# Altium schematic sheet Э3-6 Электропитание.SchDoc
size 594 x 420 mm; Address1: Address1; Address2: Address2; Address3: Address3; Address4: Address4; DocumentNumber: АБВГ.123456.001 Э3; SheetNumber: 7; SheetTotal: 7; Scale: 1:1; DocumentType: Схема электрическая принципиальная; FirstReferrence: АБВГ.123456.001
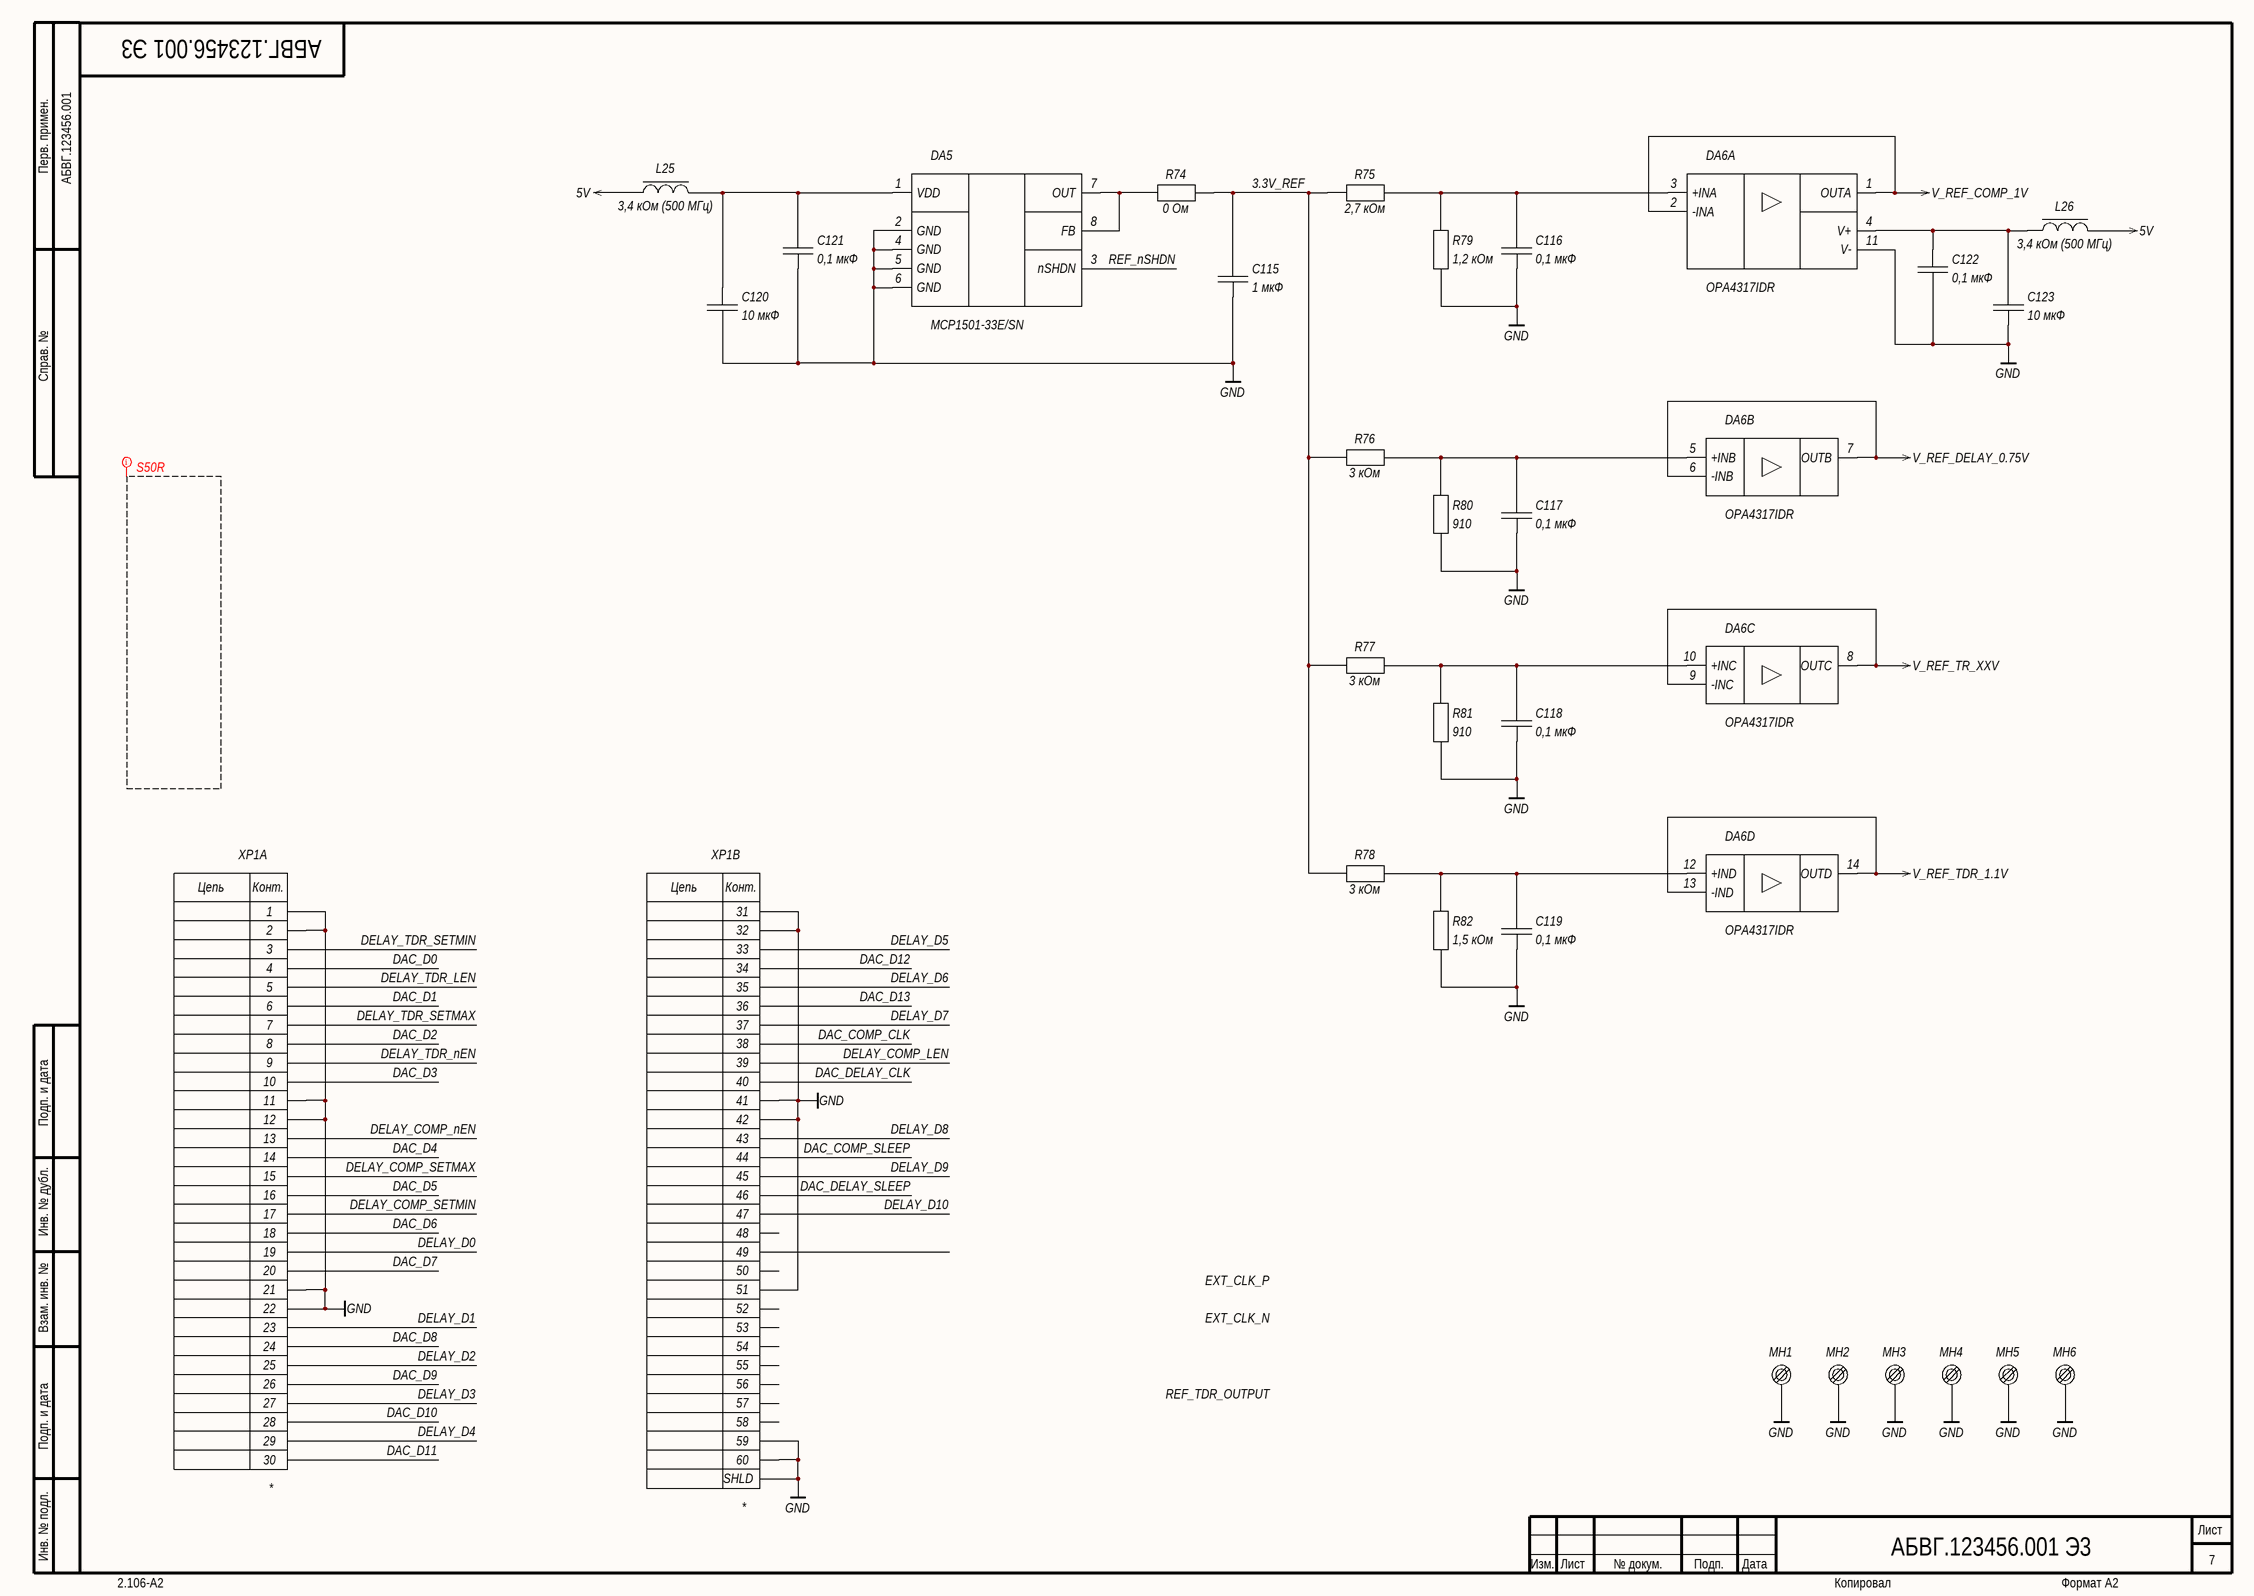
[diagram p0: Э3-6 Электропитание.SchDoc]

## Parts
C115  value 1 мкФ  [C0402-B-0.5mm]
C116  value 0,1 мкФ  [C0402-B-0.5mm]
C117  value 0,1 мкФ  [C0402-B-0.5mm]
C118  value 0,1 мкФ  [C0402-B-0.5mm]
C119  value 0,1 мкФ  [C0402-B-0.5mm]
C120  value 10 мкФ  [C0603-B-0.8mm]
C121  value 0,1 мкФ  [C0402-B-0.5mm]
C122  value 0,1 мкФ  [C0402-B-0.5mm]
C123  value 10 мкФ  [C0603-B-0.8mm]
DA5  MCP1501-33E/SN  [8-SOIC-3.9]
DA6  OPA4317IDR  [14-SOIC-3.9]  (value not drawn)  (parts A,B,C,D of 4)
L25  value 3,4 кОм (500 МГц)  [L0402-B-0.5mm]
L26  value 3,4 кОм (500 МГц)  [L0402-B-0.5mm]
MH1  Mechanical Connection  [Отверстие 2,4x5]  (value not drawn)
MH2  Mechanical Connection  [Отверстие 2,4x5]  (value not drawn)
MH3  Mechanical Connection  [Отверстие 2,4x5]  (value not drawn)
MH4  Mechanical Connection  [Отверстие 2,4x5]  (value not drawn)
MH5  Mechanical Connection  [Отверстие 2,4x5]  (value not drawn)
MH6  Mechanical Connection  [Отверстие 2,4x5]  (value not drawn)
R74  value 0 Ом  [CR0402-B-0.35mm]
R75  value 2,7 кОм  [CR0402-B-0.35mm]
R76  value 3 кОм  [CR0402-B-0.35mm]
R77  value 3 кОм  [CR0402-B-0.35mm]
R78  value 3 кОм  [CR0402-B-0.35mm]
R79  value 1,2 кОм  [CR0402-B-0.35mm]
R80  value 910  [CR0402-B-0.35mm]
R81  value 910  [CR0402-B-0.35mm]
R82  value 1,5 кОм  [CR0402-B-0.35mm]
XP1  *  [AXT460324]  (value not drawn)  (parts A,B of 2)

## Nets
5V: L25.1 L26.2
GND: C115.2 C116.2 C117.2 C118.2 C119.2 C120.2 C121.2 C122.2 C123.2 DA5.2(GND) DA5.4(GND) DA5.5(GND) DA5.6(GND) DA6.11(V-) MH1.0 MH2.0 MH3.0 MH4.0 MH5.0 MH6.0 R79.2 R80.2 R81.2 R82.2 XP1.1 XP1.2 XP1.11 XP1.12 XP1.21 XP1.22 XP1.31 XP1.32 XP1.41 XP1.42 XP1.51 XP1.59 XP1.60 XP1.SHLD
V_REF_COMP_1V: DA6.1(OUTA) DA6.2(-INA)
V_REF_DELAY_0.75V: DA6.6(-INB) DA6.7(OUTB)
V_REF_TDR_1.1V: DA6.13(-IND) DA6.14(OUTD)
V_REF_TR_XXV: DA6.8(OUTC) DA6.9(-INC)
3.3V_REF: C115.1 R74.2 R75.1 R76.1 R77.1 R78.1
DAC_COMP_CLK: XP1.38
DAC_COMP_SLEEP: XP1.44
DAC_D0: XP1.4
DAC_D1: XP1.6
DAC_D2: XP1.8
DAC_D3: XP1.10
DAC_D4: XP1.14
DAC_D5: XP1.16
DAC_D6: XP1.18
DAC_D7: XP1.20
DAC_D8: XP1.24
DAC_D9: XP1.26
DAC_D10: XP1.28
DAC_D11: XP1.30
DAC_D12: XP1.34
DAC_D13: XP1.36
DAC_DELAY_CLK: XP1.40
DAC_DELAY_SLEEP: XP1.46
DELAY_COMP_LEN: XP1.39
DELAY_COMP_nEN: XP1.13
DELAY_COMP_SETMAX: XP1.15
DELAY_COMP_SETMIN: XP1.17
DELAY_D0: XP1.19
DELAY_D1: XP1.23
DELAY_D2: XP1.25
DELAY_D3: XP1.27
DELAY_D4: XP1.29
DELAY_D5: XP1.33
DELAY_D6: XP1.35
DELAY_D7: XP1.37
DELAY_D8: XP1.43
DELAY_D9: XP1.45
DELAY_D10: XP1.47
DELAY_TDR_LEN: XP1.5
DELAY_TDR_nEN: XP1.9
DELAY_TDR_SETMAX: XP1.7
DELAY_TDR_SETMIN: XP1.3
REF_nSHDN: DA5.3(nSHDN)
NetC116_1: C116.1 DA6.3(+INA) R75.2 R79.1
NetC117_1: C117.1 DA6.5(+INB) R76.2 R80.1
NetC118_1: C118.1 DA6.10(+INC) R77.2 R81.1
NetC119_1: C119.1 DA6.12(+IND) R78.2 R82.1
NetC120_1: C120.1 C121.1 DA5.1(VDD) L25.2
NetC122_1: C122.1 C123.1 DA6.4(V+) L26.1
NetDA5_7: DA5.7(OUT) DA5.8(FB) R74.1

Not connected (* = marked no-connect by the designer): XP1 48 49 50 52 53 54 55 56 57 58

## Layout directives
net class S50R: (no net found under the mark)

## Notes on the sheet
- Цепь
- Labels drawn without touching a wire or pin: EXT_CLK_N, EXT_CLK_P, REF_TDR_OUTPUT
- Перв. примен.
- Справ. №
- Подп. и дата
- Инв. № дубл.
- Взам. инв. №
- Инв. № подл.
- Изм.
- Лист
- № докум.
- Подп.
- Дата
- 2.106-A2
- Копировал
- Формат А2
- (in symbol XP_60_SHLD_Pin_Open, part A) Конт.
- (in symbol XP_60_SHLD_Pin_Open, part B) Конт.

## Library data of the parts
C115 = Non Polar Ver.: 0402 X7R 1 мкФ ±10 % 25 В; TemperatureRange: -XX...+XX°C; Manufacturer: *; PartNumber: *; Package: *; HelpURL: *; Tolerance: *; TypeDielectric: *; ESR: *; ComponentType: CAP; VoltageRating: *
C116-C119 = Non Polar Ver.: 0402 X7R 0,1 мкФ ±10 % 50 В; TemperatureRange: -XX...+XX°C; Manufacturer: *; PartNumber: *; Package: *; HelpURL: *; Tolerance: *; TypeDielectric: *; ESR: *; ComponentType: CAP; VoltageRating: *
C120 C123 = Non Polar Ver.: 0603 X5R 10 мкФ ±20 % 25 В; PartNumber: GRM188R61E106MA73; TemperatureRange: -XX...+XX°C; VoltageRating: 25 В; Manufacturer: *; Package: *; HelpURL: *; Tolerance: *; TypeDielectric: *; ESR: *; ComponentType: CAP
C121 C122 = Non Polar Ver.: 0402 X7R 0,1 мкФ ±10 % 50 В; PartNumber: GRM155R71H104KE14D; TemperatureRange: -XX...+XX°C; VoltageRating: 50 В; Manufacturer: *; Package: *; HelpURL: *; Tolerance: *; TypeDielectric: *; ESR: *; ComponentType: CAP
DA5 = MCP1501-XXE/SN: High Precision Buffered Voltage Reference; TemperatureRange: -40...+125°C; Manufacturer: High Precision Buffered Voltage Reference; Package: 8-SOIC; PartNumber: MCP1501-33E/SN; ComponentType: IC; DatasheetURL: *; HelpURL: *; PinCount: 8
DA6 = OPA4317: Zerø-Drift, Low-Offset, Rail-to-Rail I/O Operational Amplifier; Manufacturer: Texas Instruments; TemperatureRange: -40...+125°C; Package: 14-SOIC; PartNumber: OPA4317IDR; ComponentType: IC; DatasheetURL: *; HelpURL: *; PinCount: 14
L25 L26 = Inductor MC Hor.: PartNumber: BLM15HD182BH1; TemperatureRange: -XX...+XX°C; Manufacturer: *; Package: *; HelpURL: *; MaxCurrent: *; ComponentType: IND; DatasheetURL: *; PinCount: 2
R74 = Resistor Hor.: TemperatureRange: -XX...+XX°C; Manufacturer: *; PartNumber: *; Package: *; HelpURL: *; PowerRating: *; Tolerance: *; DatasheetURL: *; ComponentType: RES
R75 = Resistor Hor.: 0402 2,7 кОм ±1 %; TemperatureRange: -XX...+XX°C; Manufacturer: *; PartNumber: *; Package: *; HelpURL: *; PowerRating: *; Tolerance: *; DatasheetURL: *; ComponentType: RES
R76-R78 = Resistor Hor.: 0402 3 кОм ±1 %; TemperatureRange: -XX...+XX°C; Manufacturer: *; PartNumber: *; Package: *; HelpURL: *; PowerRating: *; Tolerance: *; DatasheetURL: *; ComponentType: RES
R79 = Resistor Ver.: 0402 1,2 кОм ±1 %; TemperatureRange: -XX...+XX°C; Manufacturer: *; PartNumber: *; Package: *; HelpURL: *; PowerRating: *; DatasheetURL: *; Tolerance: *; ComponentType: RES
R80 R81 = Resistor Ver.: 0402 910 Ом ±1 %; TemperatureRange: -XX...+XX°C; Manufacturer: *; PartNumber: *; Package: *; HelpURL: *; PowerRating: *; DatasheetURL: *; Tolerance: *; ComponentType: RES
R82 = Resistor Ver.: 0402 1,5 кОм ±1 %; TemperatureRange: -XX...+XX°C; Manufacturer: *; PartNumber: *; Package: *; HelpURL: *; PowerRating: *; DatasheetURL: *; Tolerance: *; ComponentType: RES
XP1 = XP_60_SHLD_Pin_Open: TemperatureRange: -XX...+XX°C; Manufacturer: *; Package: *; HelpURL: *; DatasheetURL: *; PartNumber: *; PinCount: 60; ComponentType: Connector